# Altium schematic sheet Interface_Protection.SchDoc: SVPXFMC Carrier 3U
size A4; CheckedBy: \; Author: G.Kasprowicz; CompanyName: ISE; DrawnBy: T.Przywozki; Organization: WUT ISE; Address1: Warsaw University of Technology; Address2: Nowowiejska 15/19 00-665 Warsaw; Revision: 1.0.; SheetNumber: 10; SheetTotal: 20; Project: SVPXFMC Carrier 3U; ModifiedBy: -; CheckedDate: -; Title2: Interface Protection; DivGrp: ISE; Designer: G. Kasprowicz
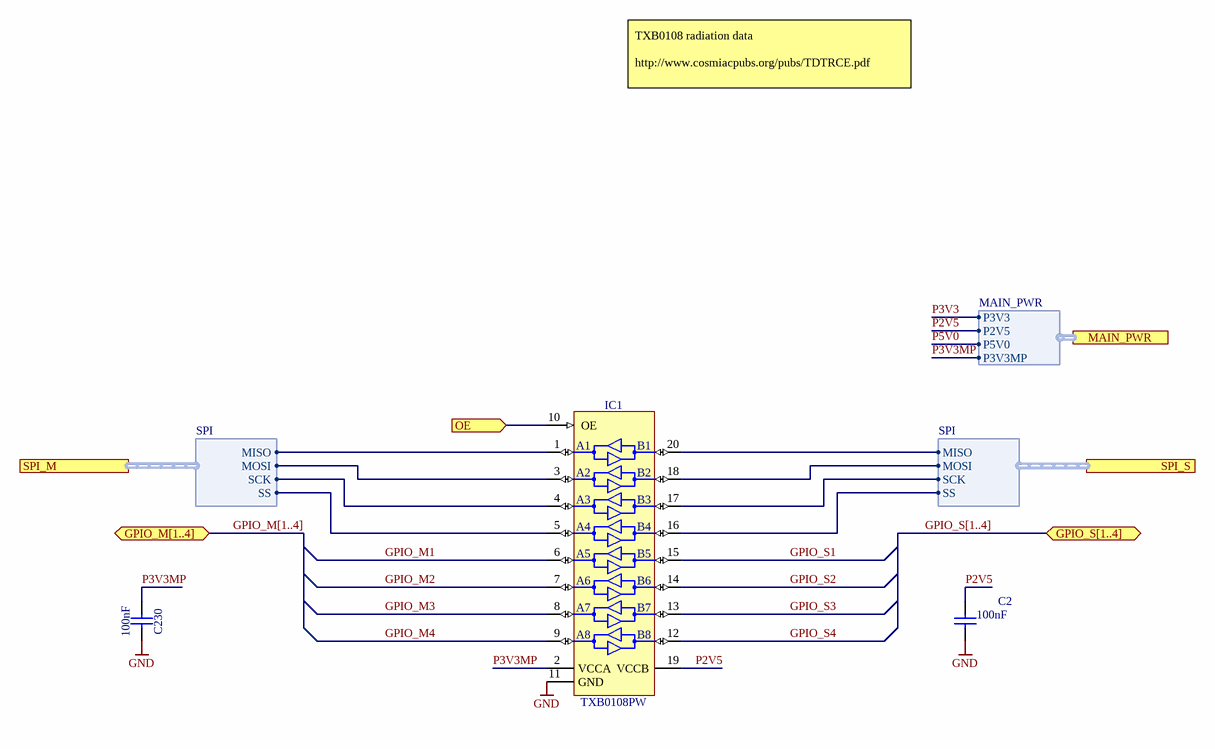
[diagram p0: Interface_Protection.SchDoc]

## Parts
C2  100nF  [CAPC1005X55N]
C230  100nF  [CAPC1005X55N]
IC1  TXB0108PW  [SOP65P640X120-20N]

## Ports
GPIO_M[1..4] (bidir), GPIO_S[1..4] (bidir), MAIN_PWR (harness MAIN_PWR), OE (in), SPI_M (harness SPI), SPI_S (harness SPI)

## Harnesses
SPI: MISO, MOSI, SCK, SS
MAIN_PWR: P3V3, P2V5, P5V0, P3V3MP

## Nets
GND: C2.2 C230.2 IC1.11(GND)
GPIO_M1: IC1.6(A5)
GPIO_M2: IC1.7(A6)
GPIO_M3: IC1.8(A7)
GPIO_M4: IC1.9(A8)
GPIO_S1: IC1.15(B5)
GPIO_S2: IC1.14(B6)
GPIO_S3: IC1.13(B7)
GPIO_S4: IC1.12(B8)
OE: IC1.10(OE) ; port OE
P2V5: C2.1 IC1.19(Vccb) ; port MAIN_PWR.P2V5
P3V3: port MAIN_PWR.P3V3
P3V3MP: C230.1 IC1.2(Vcca) ; port MAIN_PWR.P3V3MP
P5V0: port MAIN_PWR.P5V0
NetIC1_1: IC1.1(A1) ; port SPI_M.MISO
NetIC1_3: IC1.3(A2) ; port SPI_M.MOSI
NetIC1_4: IC1.4(A3) ; port SPI_M.SCK
NetIC1_5: IC1.5(A4) ; port SPI_M.SS
NetIC1_16: IC1.16(B4) ; port SPI_S.SS
NetIC1_17: IC1.17(B3) ; port SPI_S.SCK
NetIC1_18: IC1.18(B2) ; port SPI_S.MOSI
NetIC1_20: IC1.20(B1) ; port SPI_S.MISO

## Buses and harness runs
bus GPIO_M[1..4] = port GPIO_M[1..4]
bus GPIO_S[1..4] = port GPIO_S[1..4]

## Notes on the sheet
- TXB0108 radiation data
  http://www.cosmiacpubs.org/pubs/TDTRCE.pdf
- Project/Equipment
- Document
- Designer
- Drawn by
- Check.by
- Copyright WUT ISE 2019
  This documentation describes Open Hardware and is licensed under the CERN OHL v.1.1. You may redistribute and modify this documentation under the terms of the CERN OHL v1.1.
  (http://ohwr.org/CERNOHL). This documentation is dristributed WITHOUT ANY EXPRESS OR IMPLIED WARRANTY, INCLUDING OF MERCHANTABILITY, SATISFACTORY QUALITY AND FITNESS FOR A PARTICULAR PURPOSE. Please see the CERN OHL v.1.1 for applicable conditions
- File
- Last Mod.
- Print Date
- Sheet
- Size
- A4
- of
- Rev
- (in symbol TXB0108PW) VCCA; VCCB

## Library data of the parts
C2 C230 = CC0402_100NF_25V_10%_X7R_YUDEN_TMK105B7104KVHF: Non-polarised capacitor; Part Description: SMD Multilayer Chip Ceramic Capacitor (High Dielectric Type) for Automotive / Industrial Applications; Manufacturer: TAIYO YUDEN; Voltage: 25V; TC: X7R; Tolerance: ±10%; Part Number: CC0402_100NF_25V_10%_X7R_YUDEN_TMK105B7104KVHF; Component Kind: Standard; Component Type: Standard; Pin Count: 2; Value: 100nF; Status: Not Recommended; Manufacturer Part Number: TMK105B7104KVHF; Case: 0402; Mounted: Yes; Socket: No; SMD: Yes; Sense: No; HelpURL: \\cern.ch\dfs\Applications\Altium\Datasheets\CC0402_TAIYO-YUDEN_TMK105B7104KVHF.pdf; Author: CERN DEM JLC; CreateDate: 10/05/2017; LatestRevisionDate: 10/05/2017; ComponentHeight: 0.55mm
IC1 = TXB0108PW: 8-Bit Bidirectional Voltage-Level Translator with Automatic Direction Sensing and ±15kV ESD Protection; Manufacturer: TEXAS INSTRUMENTS; PressFit: No; Bonding: No; Part Number: TXB0108PW; Component Kind: Standard; Component Type: Standard; Device: TXB0108PW; PackageDescription: SOP, 20-Leads, Body 6.5x4.4mm, Pitch 0.65mm, IPC Medium Density; Part Description: 8-Bit Bidirectional Voltage-Level Translator with Automatic Direction Sensing and ±15kV ESD Protection; Manufacturer Part Number: TXB0108PW; Pin Count: 20; Case: TSSOP20; Mounted: Yes; Socket: No; SMD: Yes; Sense: No; ComponentHeight: 1.2mm; Author: CERN DEM MR; HelpURL: \\cern.ch\dfs\Applications\Altium\Datasheets\TXB0108PW.pdf; CreateDate: 01.04.2016; LatestRevisionDate: 01.04.2016